# Altium schematic sheet Power Supply.SchDoc
size A4
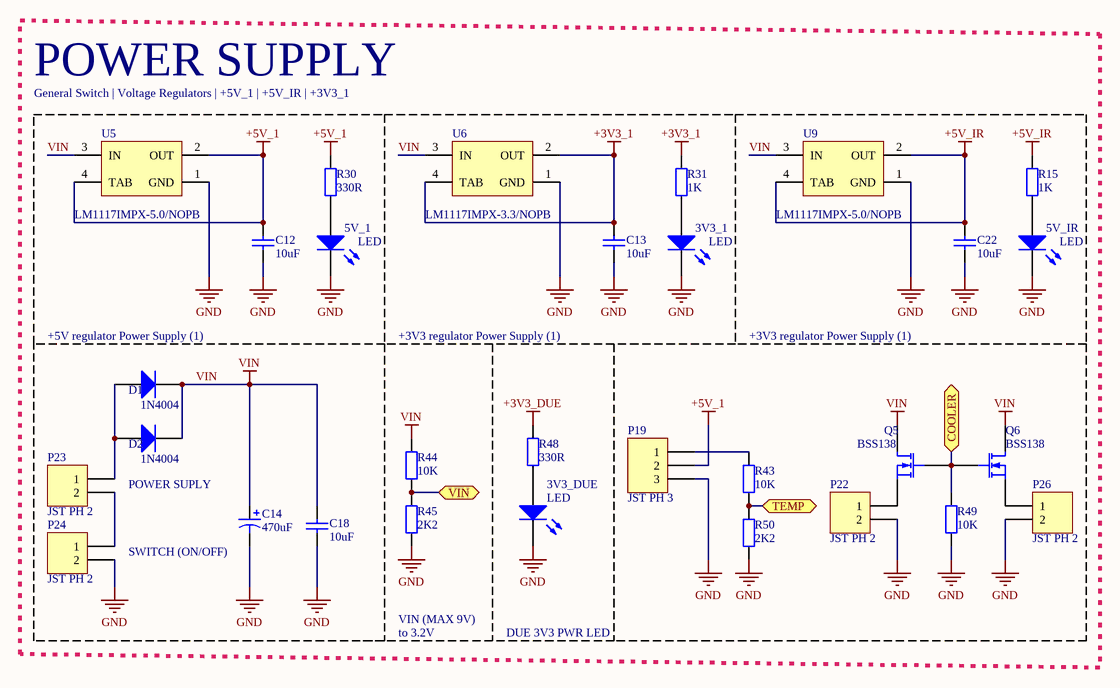
[diagram p0: Power Supply.SchDoc]

## Parts
3V3_1  LED  [LED0805]
3V3_DUE  LED  [LED0805]
5V_1  LED  [LED0805]
5V_IR  LED  [LED0805]
C12  10uF  [C1206]
C13  10uF  [C1206]
C14  470uF  [E]
C18  10uF  [C1206]
C22  10uF  [C1206]
D1  1N4004  [DIODESMA]
D2  1N4004  [DIODESMA]
P19  JST PH 3  [B3B-PH-K]
P22  JST PH 2  [B2B-PH-K]
P23  JST PH 2  [B2B-PH-K]
P24  JST PH 2  [B2B-PH-K]
P26  JST PH 2  [B2B-PH-K]
Q5  BSS138  [SOT23]
Q6  BSS138  [SOT23]
R15  1K  [RES1206]
R30  330R  [RES1206]
R31  1K  [RES1206]
R43  10K  [RES1206]
R44  10K  [RES1206]
R45  2K2  [RES1206]
R48  330R  [RES1206]
R49  10K  [RES1206]
R50  2K2  [RES1206]
U5  LM1117IMPX-5.0/NOPB  [MP04A_N]
U6  LM1117IMPX-3.3/NOPB  [MP04A_N]
U9  LM1117IMPX-5.0/NOPB  [MP04A_N]

## Blocks framed on the sheet
POWER SUPPLY: 3V3_1 3V3_DUE 5V_IR C13 C14 C18 C22 D1 D2 P19 P22-P24 P26 Q5 Q6 R15 R31 R43-R45 R48-R50 U6 U9
+5V regulator Power Supply (1): 5V_1 C12 R30 U5

## Ports
COOLER, TEMP, VIN

## Nets
+3V3_1: C13.2 R31.2 U6.2(OUT) U6.4(TAB)
+3V3_DUE: R48.2
+5V_1: C12.2 P19.2 R30.2 U5.2(OUT) U5.4(TAB)
+5V_IR: C22.2 R15.2 U9.2(OUT) U9.4(TAB)
GND: 3V3_1.2(K) 3V3_DUE.2(K) 5V_1.2(K) 5V_IR.2(K) C12.1 C13.1 C14.2 C18.1 C22.1 P19.3 P22.2 P24.2 P26.2 R45.1 R49.2 R50.2 U5.1(GND) U6.1(GND) U9.1(GND)
VIN: C14.1 C18.2 D1.1(K) D2.1(K) Q5.1(D) Q6.1(D) R44.2 U5.3(IN) U6.3(IN) U9.3(IN)
COOLER: Q5.3(G) Q6.3(G) R49.1 ; port COOLER
TEMP: R43.2 R50.1 ; port TEMP
VIN: R44.1 R45.2 ; port VIN  [a separate net that carries the same name]
Net3V3_1_1: 3V3_1.1(A) R31.1
Net3V3_DUE_1: 3V3_DUE.1(A) R48.1
Net5V_1_1: 5V_1.1(A) R30.1
Net5V_IR_1: 5V_IR.1(A) R15.1
NetD1_2: D1.2(A) D2.2(A) P23.1
NetP19_1: P19.1 R43.1
NetP22_1: P22.1 Q5.2(S)
NetP23_2: P23.2 P24.1
NetP26_1: P26.1 Q6.2(S)

## Notes on the sheet
- General Switch | Voltage Regulators | +5V_1 | +5V_IR | +3V3_1
- +3V3 regulator Power Supply (1)
- POWER SUPLY
- SWITCH (ON/OFF)
- VIN (MAX 9V)
- to 3.2V
- DUE 3V3 PWR LED

## Library data of the parts
C12 C13 C18 C22 = Cap Semi: Capacitor (Semiconductor SIM Model); Published: 8-Jun-2000; LatestRevisionDate: 29-May-2009; LatestRevisionNote: IPC-7351 Footprint Added.; PackageReference: C1206; Publisher: Altium Limited; PackageDescription: Chip Capacitor; Value: 10uF
C14 = 94SA107X0010EBP: Solid Aluminum Capacitor with Organic Semiconductor Electrolyte: 100uF, 10V, Bulk Pack; Note: Part Numbers shown are for ± 20% capacitance tolerance (X0).; PCB_Layout: Complies with Manufacturer's Recommendation.; DrillSize: Nominal, Rounded to the nearest 0.1mm; Published: 19-Mar-2004; DatasheetDocument: 29-Jun-2001; PackageReference: E; Publisher: Altium Limited; ComponentLink1Description: Manufacturer Link; ComponentLink1URL: http://www.vishay.com/; ComponentLink2Description: Datasheet; ComponentLink2URL: http://www.vishay.com/docs/90003/94sa.pdf; Value: 100uF
D1 D2 = DIODE
Q5 Q6 = BSS138: N-Channel Enhancement Mode Vertical DMOS FET; Published: 17-Dec-2003; DatasheetVersion: Mar-96; PackageVersion: 1996; PackageReference: SOT23; Publisher: Altium Limited; PackageDescription: SOT-23; 3 Leads; Body 3.1 x 2.5 mm, inc. leads (LxW max), Alternate Lead Configuration; ComponentLink1Description: Manufacturer Link; ComponentLink1URL: http://www.zetex.com/; ComponentLink2Description: Datasheet; ComponentLink2URL: www.zetex.com/3.0/pdf/BSS138.pdf
R15 R30 R31 R43-R45 R48-R50 = RES
U5 U9 = LM1117IMPX-5.0/NOPB: 800mA Low-Dropout Linear Regulator, 4-pin SOT-223, Pb-Free; Manufacturer: National Semiconductor; PackageTopMarking: XYTT*N06B; PowerWise: N; CompType: LDO IC; Published: 1-Mar-2010; DatasheetVersion: Apr-2006; PackageVersion: revB, Apr-2003; PackageReference: MP04A; Publisher: Altium Limited; PackageDescription: Molded SOT-223, 6.50 x 3.56 x 1.6mm Body, 4 Lead, 2.3mm Pitch; Supplier 1: Digi-Key; Supplier Part Number 1: LM1117IMPX-5.0-ND; PartNumber: LM1117IMPX-5.0/NOPB; RoHS: Y; PinCount: 4; Code_JEDEC: TO-261-AA; Code_IPC: SOT223-4; ComponentLink1Description: LM1117 Datasheet; ComponentLink1URL: http://www.national.com/ds/LM/LM1117.pdf; ComponentLink2Description: LM1117 Web Page; ComponentLink2URL: http://www.national.com/pf/LM/LM1117.html; ComponentLink3Description: MP04A Package Page; ComponentLink3URL: http://www.national.com/packaging/folders/mp04a.html
U6 = LM1117IMPX-3.3/NOPB: 800mA Low-Dropout Linear Regulator, 4-pin SOT-223, Pb-Free; Manufacturer: National Semiconductor; PackageTopMarking: XYTT*N05B; PowerWise: N; CompType: LDO IC; Published: 1-Mar-2010; DatasheetVersion: Apr-2006; PackageVersion: revB, Apr-2003; PackageReference: MP04A; Publisher: Altium Limited; PackageDescription: Molded SOT-223, 6.50 x 3.56 x 1.6mm Body, 4 Lead, 2.3mm Pitch; Supplier 1: Digi-Key; Supplier Part Number 1: LM1117IMPX-3.3-ND; PartNumber: LM1117IMPX-3.3/NOPB; RoHS: Y; PinCount: 4; Code_JEDEC: TO-261-AA; Code_IPC: SOT223-4; ComponentLink1Description: LM1117 Datasheet; ComponentLink1URL: http://www.national.com/ds/LM/LM1117.pdf; ComponentLink2Description: LM1117 Web Page; ComponentLink2URL: http://www.national.com/pf/LM/LM1117.html; ComponentLink3Description: MP04A Package Page; ComponentLink3URL: http://www.national.com/packaging/folders/mp04a.html